# EAGLE design THS-badge (EAGLE 5.11)
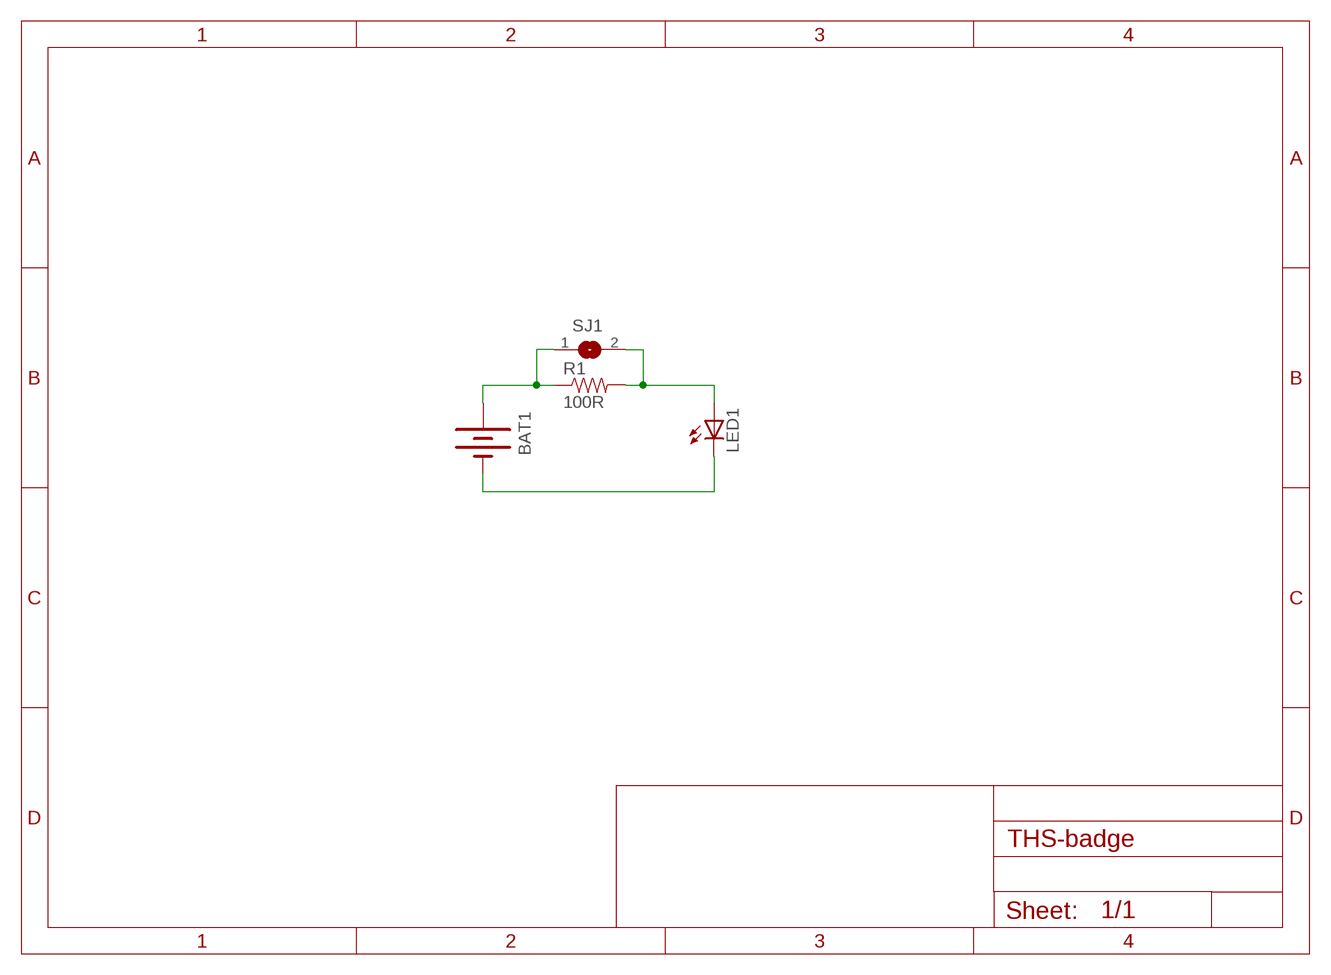
[diagram p0: schematic, sheet 1]

## Parts
BAT1  BATTERY20SMD  [BATTCON_20MM]
LED1  LED5MM  [LED5MM]
R1  100R  RESISTORPTH-1/4W  [AXIAL-0.4]
SJ1  SJ  [SJ]

## Nets
N$1: BAT1.1(+) R1.P$1 SJ1.1
N$2: LED1.A R1.P$2 SJ1.2
N$3: BAT1.2(-) LED1.K(C)

## Library data of the parts
BAT1 = SparkFun:BATTERY: Battery Holders Various common sizes : AA, AAA, 20mm coin cell and 12mm coin cell.
LED1 = SparkFun:LED: LEDs Standard schematic elements and footprints for 5mm, 3mm, 1206, and 0603 sized LEDs. 5mm - Spark Fun Electronics SKU : COM-00529 (and others)
R1 = SparkFun:RESISTOR: Resistor Basic schematic elements and footprints for 0603, 1206, and PTH resistors.
SJ1 = jumper:SJ: SMD solder JUMPER

## Board
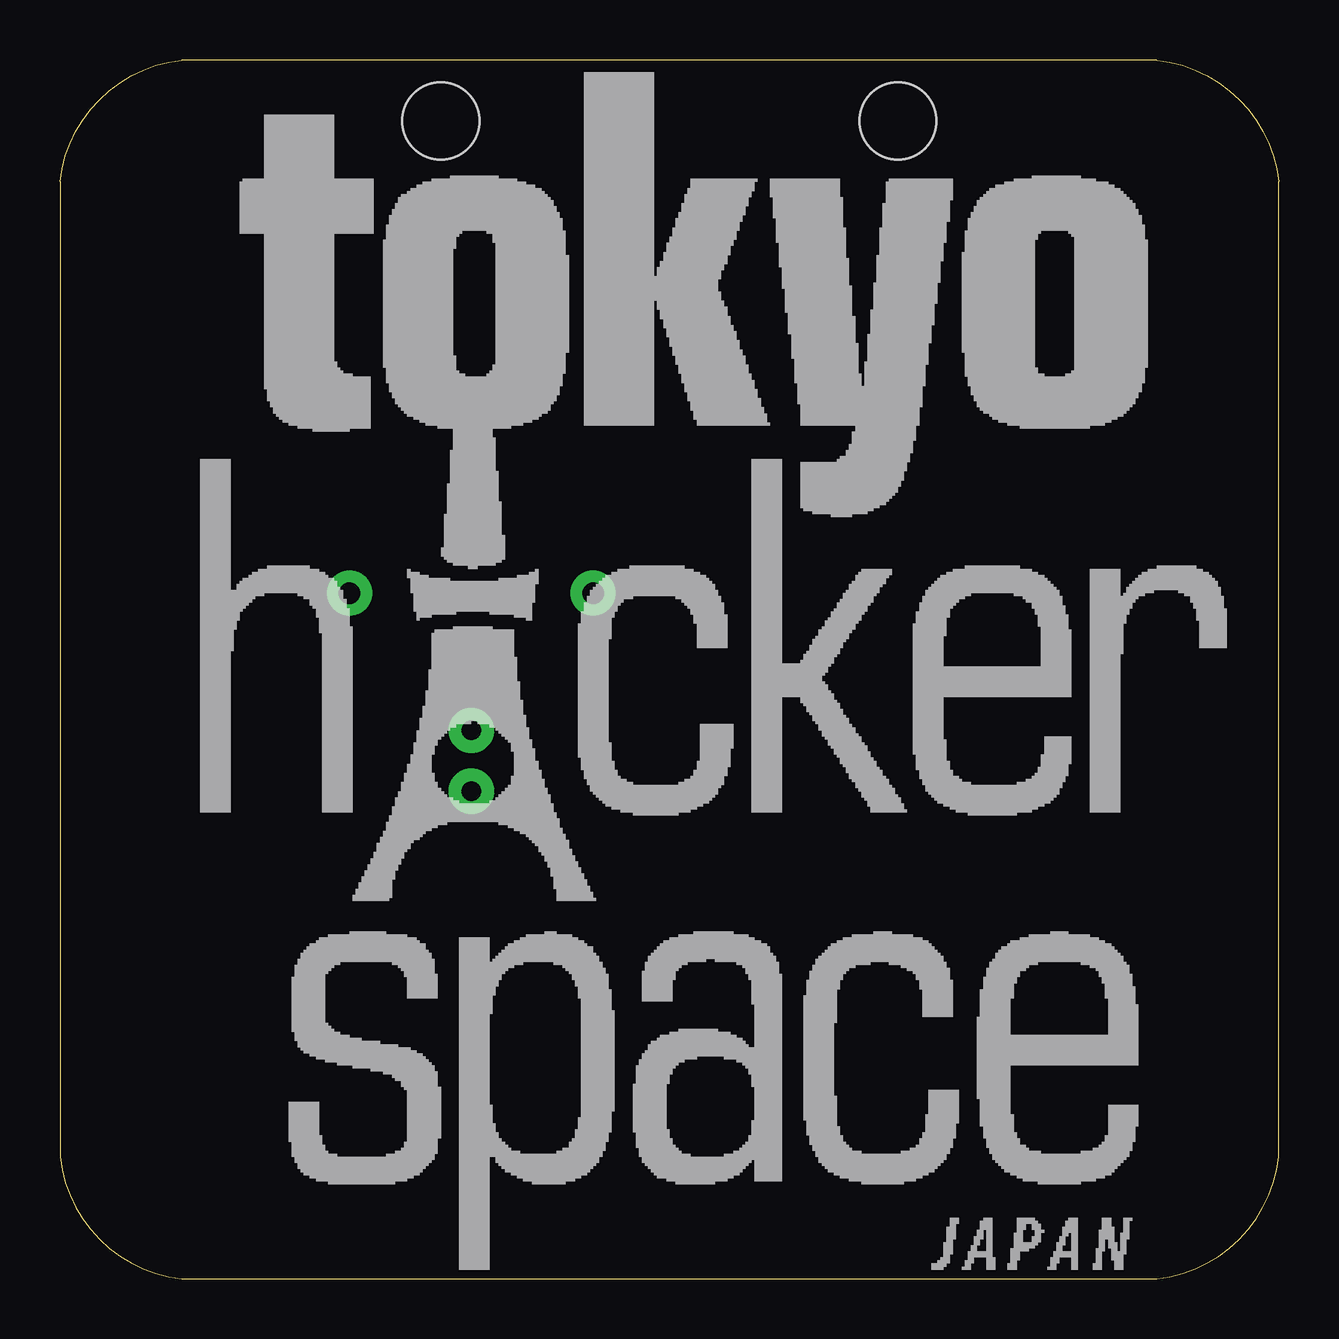
[diagram p1: board, top side]
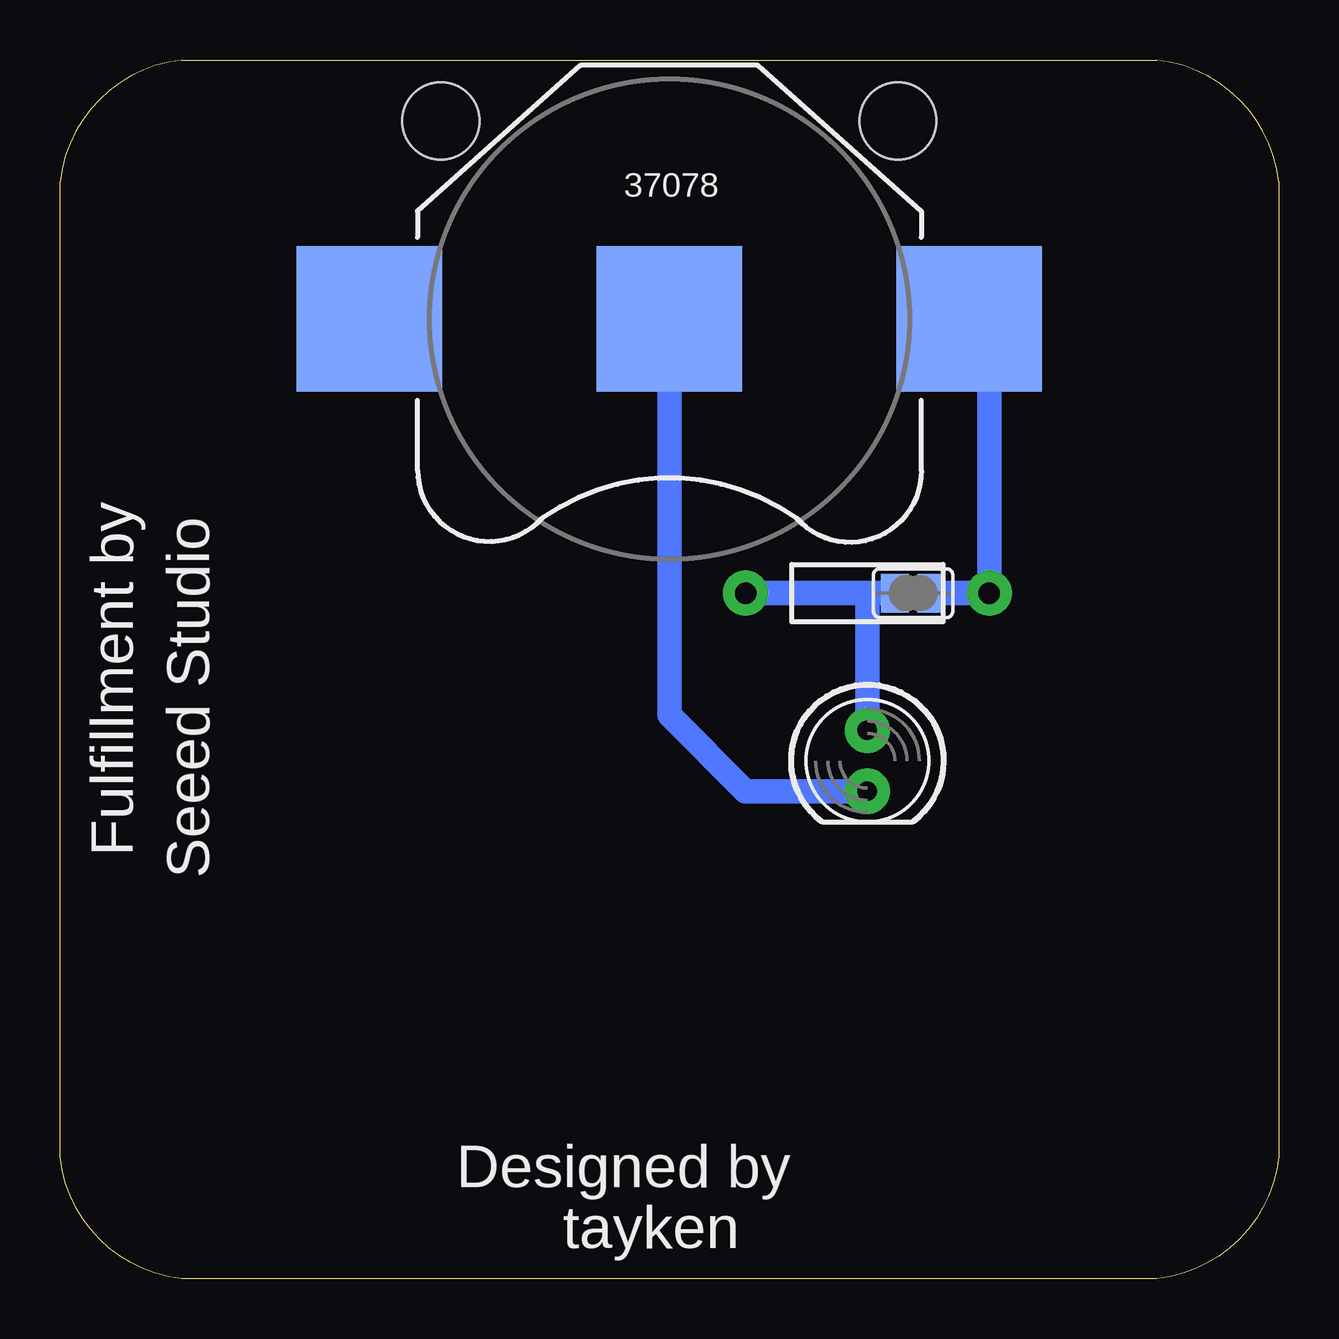
[diagram p2: board, bottom side, seen from below]

Size 50.8 x 50.8 mm. Coordinates in mm from the lower left corner, seen from the top.
Outline: 5.08,0 45.72,0 arc77 50.8,5.08 50.8,45.72 arc77 45.72,50.8 5.08,50.8 arc77 0,45.72 0,5.08 arc77 5.08,0
Copper layers (1*16): Top 0.035mm / dielectric 1.5mm / Bottom 0.035mm
Design rules "Fusion_eagle_rule_v1.1": minimum track width 6mil, minimum drill 12mil, track to track 6mil, track to pad 6mil, pad to pad 6mil, via to via 6mil, smd to smd 0mil, copper to edge 10mil, drill to drill 10mil, minimum pad ring 10mil, minimum via ring 6mil, stop-mask expansion 2mil, vias tented up to drill 100mil, thermal gap 10mil
Holes 3.2 mm at 15.88,48.26 34.92,48.26

### Footprints (pad centres in the part's own frame; a part is rotated, then mirrored left to right if it is on the bottom)
BATTCON_20MM = smd 6.07 x 6.07: 1 -12.5,0; 2 0,0; 3 12.5,0
LED5MM = drill 0.813 pad 1.88 round: A -1.27,0; K 1.27,0
AXIAL-0.4 = drill 0.9 pad 1.88 round: P$1 -5.08,0; P$2 5.08,0
SJ = smd 1.168 x 1.6: 1 -0.762,0; 2 0.762,0

### Placement (x,y rotation side)
BAT1  25.4,40.01 180 bottom
LED1  17.14,21.59 270 bottom
R1  17.14,28.57 180 bottom
SJ1  15.24,28.57 180 bottom
U$1  [THS]  3.81,-0.64 0 top

### Tracks (layer width: path | path; a pad name or v marks a point on that pad's centre or on a via)
N$1
  Bottom 1.016: BAT1.1 12.9,39.37 12.06,39.37 R1.P$1 SJ1.1
N$2
  Bottom 1.016: 17.14,28.57 SJ1.2 | 17.14,28.57 R1.P$2 | LED1.A 17.14,28.57
N$3
  Bottom 1.016: LED1.K 22.23,20.32 25.4,23.5 BAT1.2

### Text on the board
bPlace: 37078 | Seeed Studio | Fulfillment by | Designed by | tayken